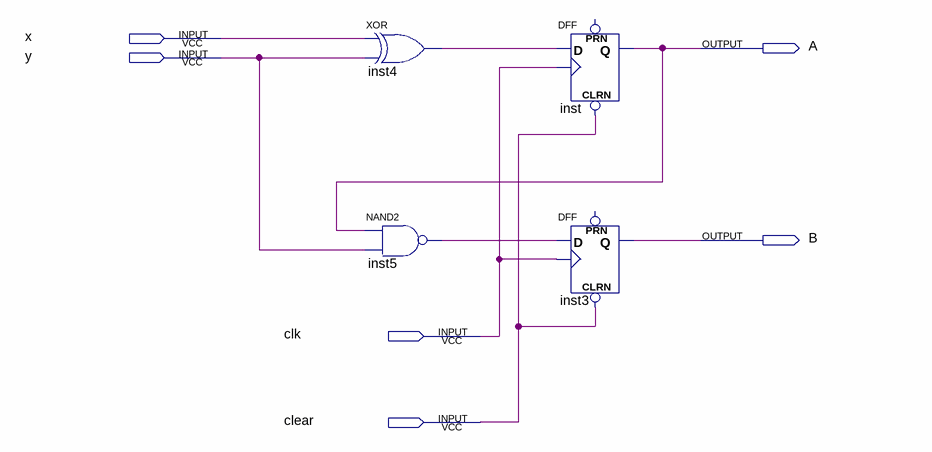
[diagram p0: schematic sheet]
// Quartus schematic Lab01_B0729008.bdf as structural Verilog: 4 symbols, 6 pins
module Lab01_B0729008 (
  input  x,
  input  y,
  input  clk,
  input  clear,
  output A,
  output B
);

  wire inst4_out, inst5_out;

  xor inst4 (inst4_out, x, y);
  nand inst5 (inst5_out, A, y);
  DFF inst (.CLRN(clear), .CLK(clk), .D(inst4_out), .Q(A));  // open: PRN
  DFF inst3 (.CLRN(clear), .CLK(clk), .D(inst5_out), .Q(B));  // open: PRN
endmodule
